# EAGLE design mini system (EAGLE 9.2.2)
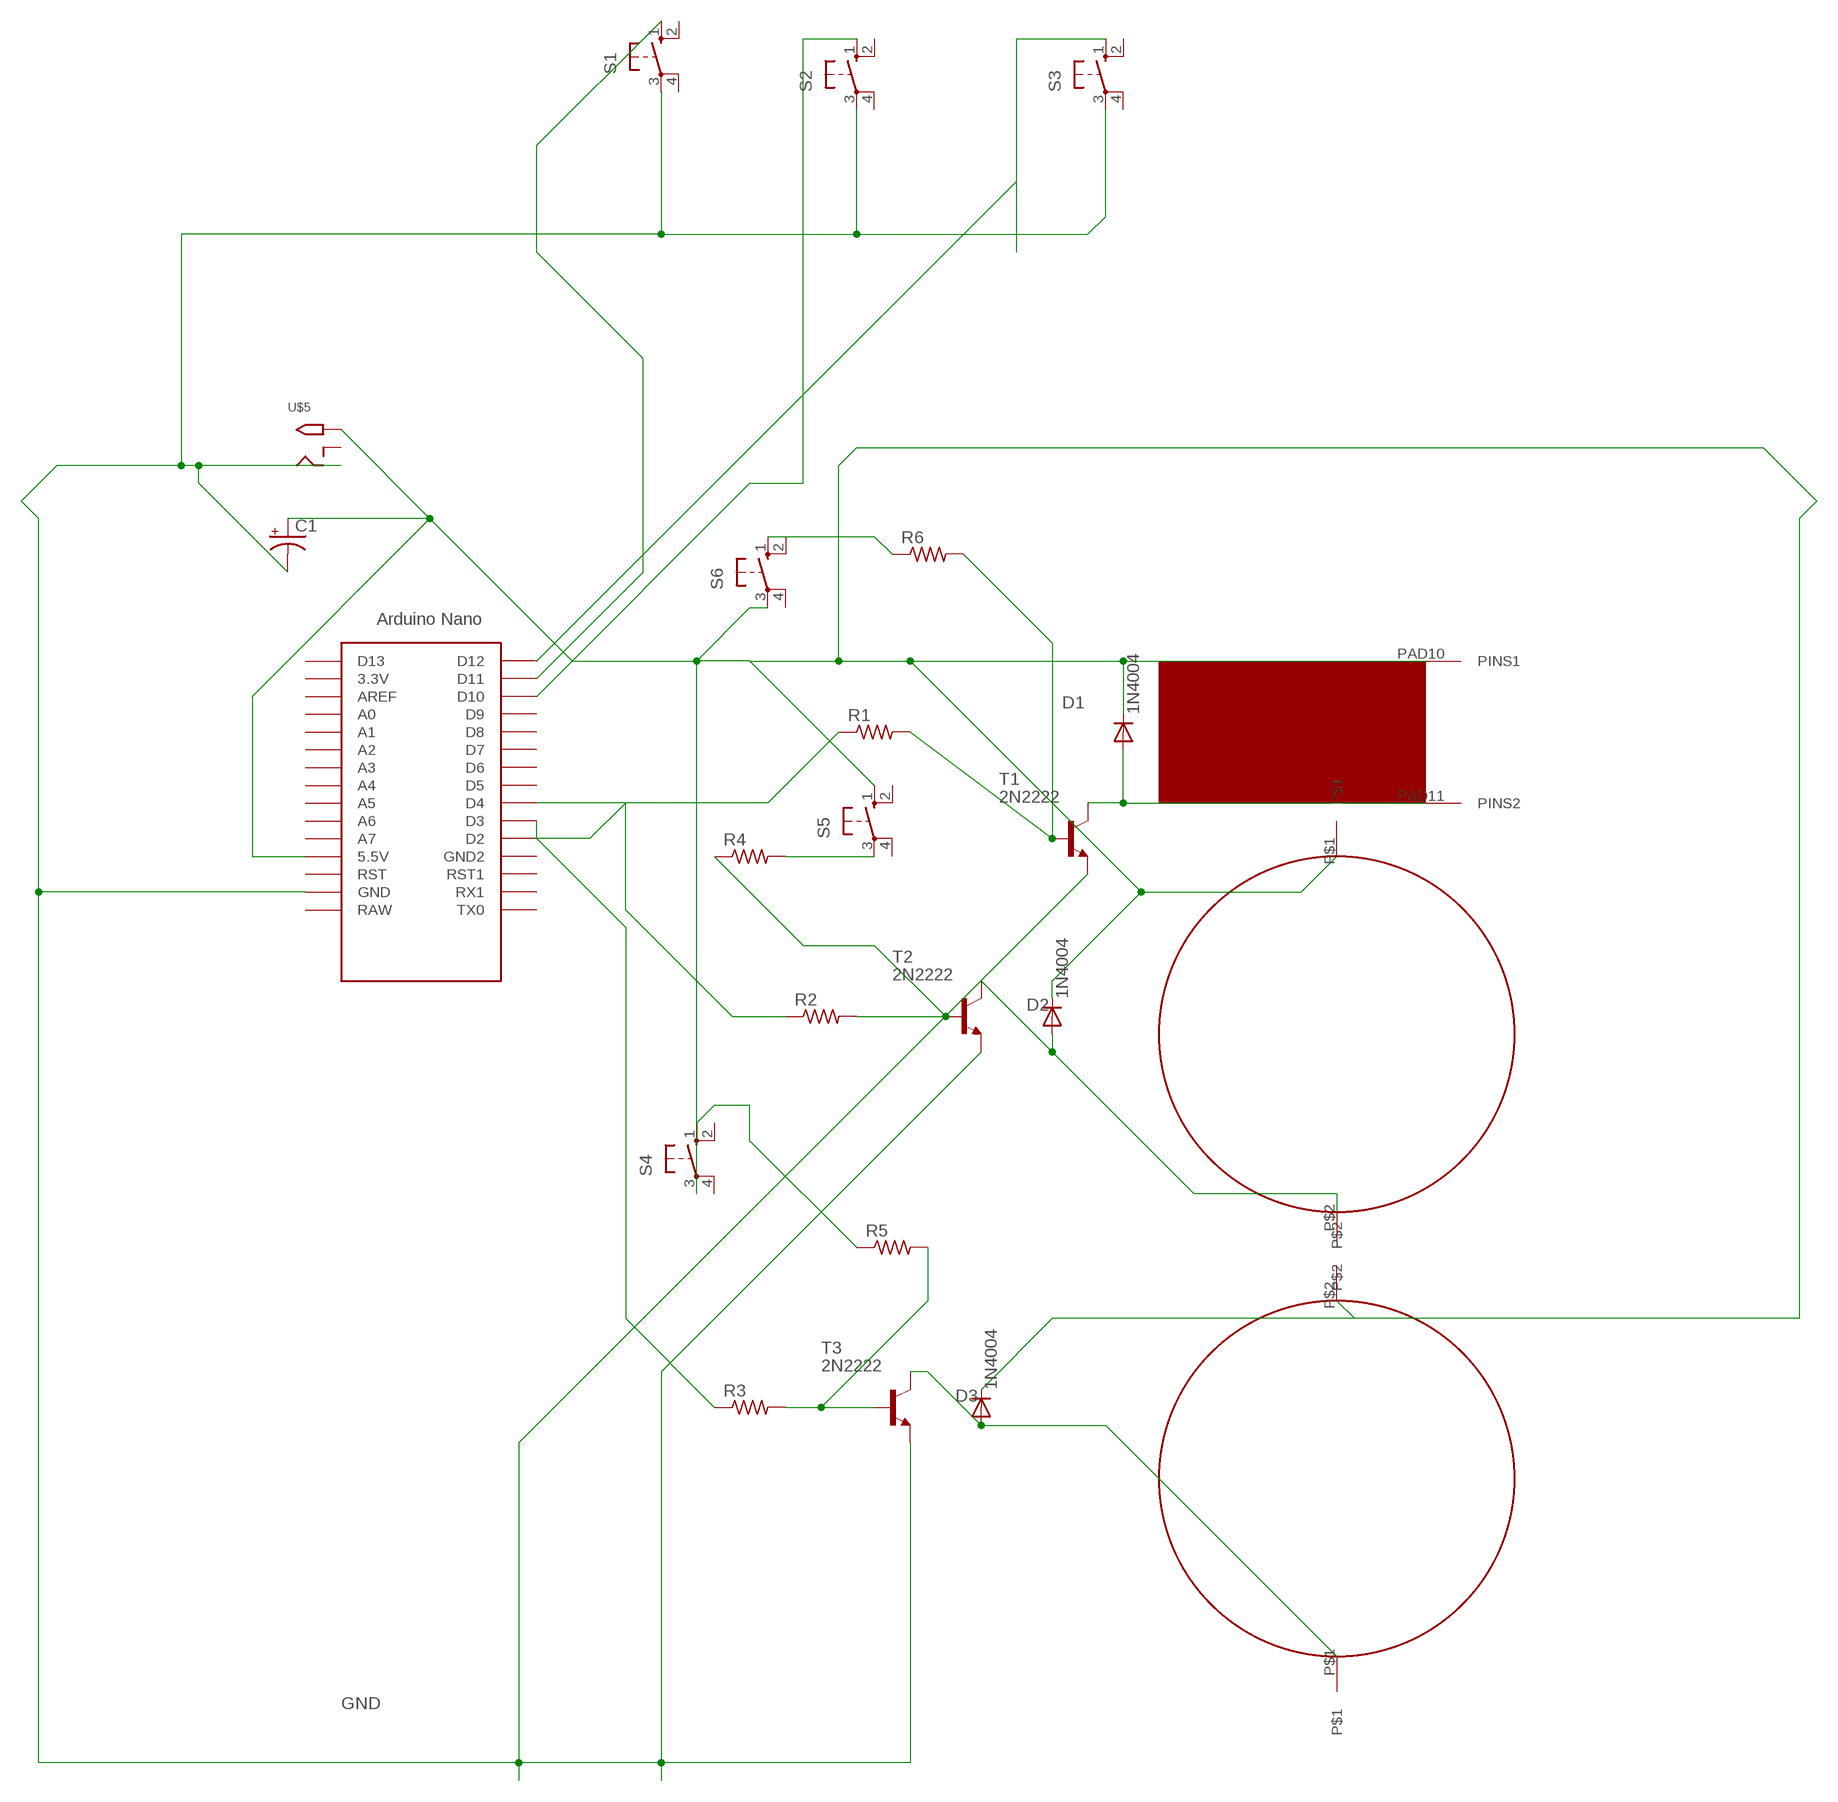
[diagram p0: schematic, sheet 1]

## Parts
C1  CPOL-USE2.5-5  [E2,5-5]
D1  1N4004  [DO41-10]
D2  1N4004  [DO41-10]
D3  1N4004  [DO41-10]
PUMP1  DCPUMP  [PUMP]
R1  R-US_0207/10  [0207/10]
R2  R-US_0207/10  [0207/10]
R3  R-US_0207/10  [0207/10]
R4  R-US_0207/10  [0207/10]
R5  R-US_0207/10  [0207/10]
R6  R-US_0207/10  [0207/10]
S1  10-XX  [B3F-10XX]
S2  10-XX  [B3F-10XX]
S3  10-XX  [B3F-10XX]
S4  10-XX  [B3F-10XX]
S5  10-XX  [B3F-10XX]
S6  10-XX  [B3F-10XX]
T1  2N2222  [TO92-EBC-OVAL]
T2  2N2222  [TO92-EBC-OVAL]
T3  2N2222  [TO92-EBC-OVAL]
U$1  NANO  [NANO]
U$2  VALVE  [VALVTEST2]
U$4  DCPUMP  [PUMP]
U$5  2.1MMJACKTHM  [PJ-102A]

## Nets
5V: C1.+ D1.C D2.C D3.C PUMP1.P$1 S4.3(P) S5.1(S) S6.3(P) U$1.5V(5.5V) U$2.PAD10(PINS1) U$4.P$2 U$5.TIP
GND: C1.- S1.3(P) S2.3(P) S3.3(P) T1.E T2.E T3.E U$1.GND U$5.RING
N$1: R1.2 R6.2 T1.B
N$2: R2.2 R4.1 T2.B
N$3: R3.2 R5.2 T3.B
N$4: R1.1 U$1.D4
N$5: D2.A PUMP1.P$2 T2.C
N$6: R3.1 U$1.D3
N$7: R2.1 U$1.D2
N$8: D1.A T1.C U$2.PAD11(PINS2)
N$9: D3.A T3.C U$4.P$1
N$10: R4.2 S5.3(P)
N$11: S1.1(S) U$1.D11
N$12: S2.1(S) U$1.D10
N$13: S3.1(S) U$1.D12
N$14: R6.1 S6.1(S)
N$15: R5.1 S4.1(S)
Unconnected: S1.2(S1) S1.4(P1) S2.2(S1) S2.4(P1) S3.2(S1) S3.4(P1) S4.2(S1) S4.4(P1) S5.2(S1) S5.4(P1) S6.2(S1) S6.4(P1) U$1.3.3V U$1.A0 U$1.A1 U$1.A2 U$1.A3 U$1.A4 U$1.A5 U$1.A6 U$1.A7 U$1.AREF U$1.D5 U$1.D6 U$1.D7 U$1.D8 U$1.D9 U$1.D13 U$1.GND1(GND2) U$1.RAW U$1.RST U$1.RST1 U$1.RX1 U$1.TX0 U$5.RING_SW

## Library data of the parts
C1 = adafruit:CPOL-US: POLARIZED CAPACITOR, American symbol
D1-D3 = adafruit:1N4004: DIODE General purpose 1N400x type rectifier (With bigger pads) http://www.ladyada.net/library/pcb/eaglelibrary.html
PUMP1 U$4 = local eagle library:DCPUMP
R1-R6 = adafruit:R-US_: RESISTOR, American symbol
S1-S6 = switch-omron:10-XX: OMRON SWITCH; MPN: B3F-1000; OC_FARNELL: 176432; OC_NEWARK: 36M3542
T1-T3 = adafruit:2N2222: NPN TRANSISTOR Big oval pads
U$1 = Arduino-clone:NANO: Arduino Nano
U$2 = local eagle library:VALVE: pn eumatic valve
U$5 = adafruit:2.1MMJACK: 2.1mm x 5.5mm THM DC jack with internal switch. Digikey part #PJ-102A, 4UCON part #05537 2.1mm x 5.5mm SMT DC jack with internal switch. Digikey part #PJ-002A-SMT, 4UCON part #03267 By microbuilder.eu & adafruit.com

## Board
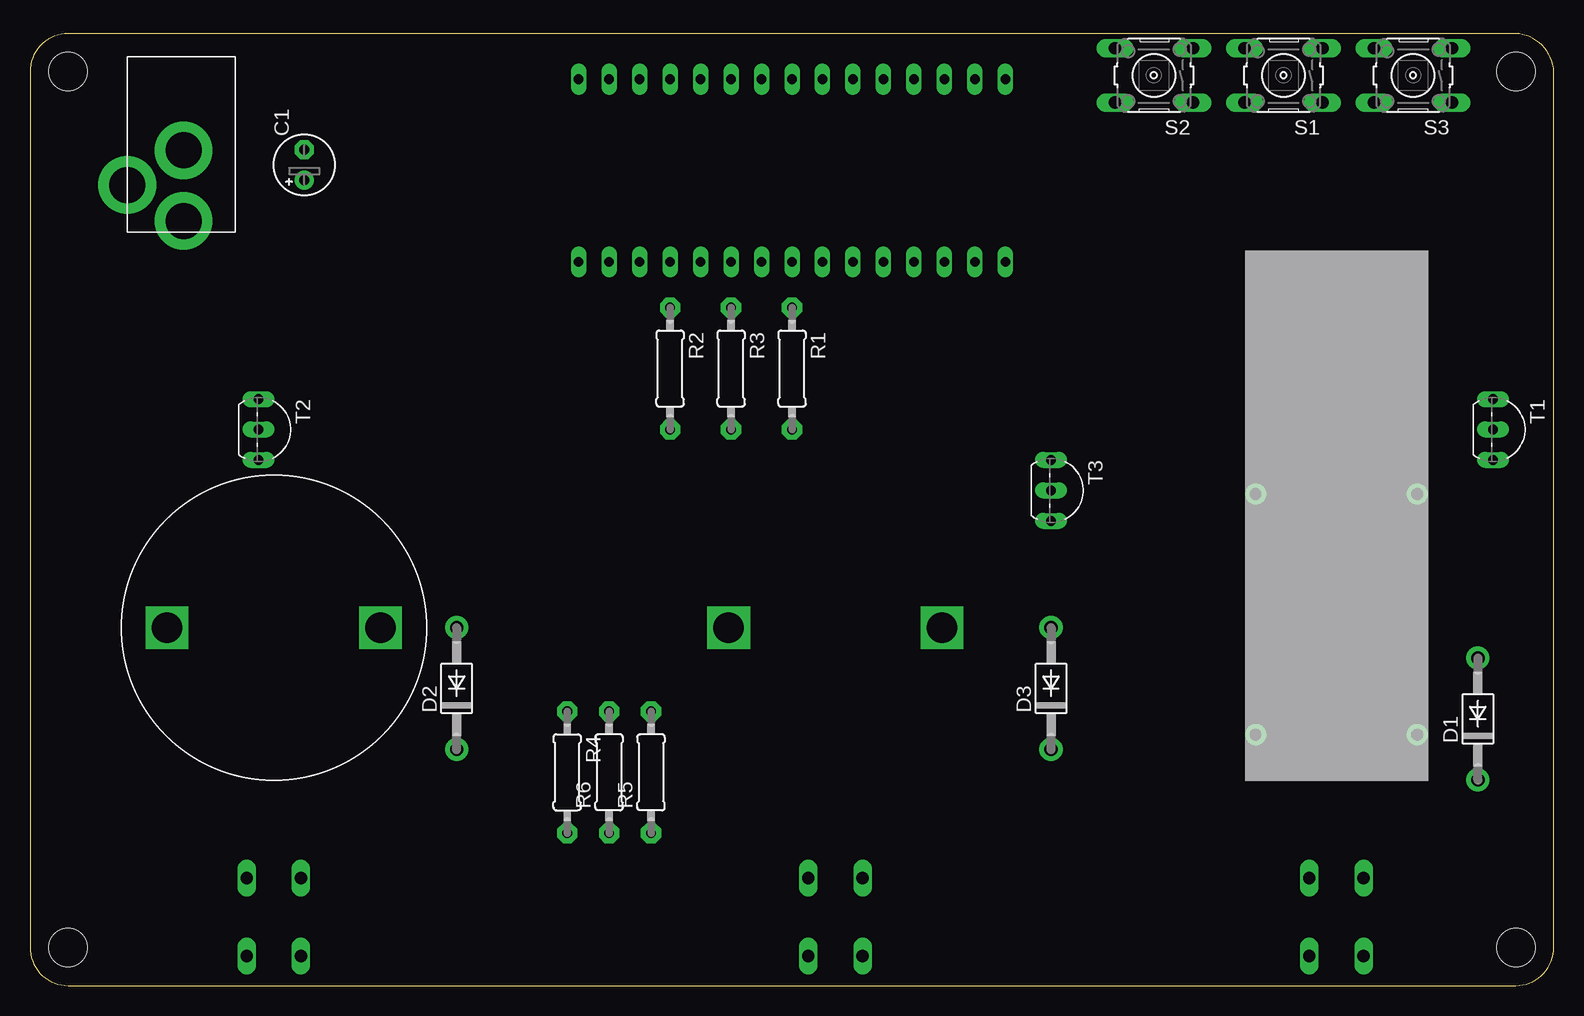
[diagram p1: board, top side]
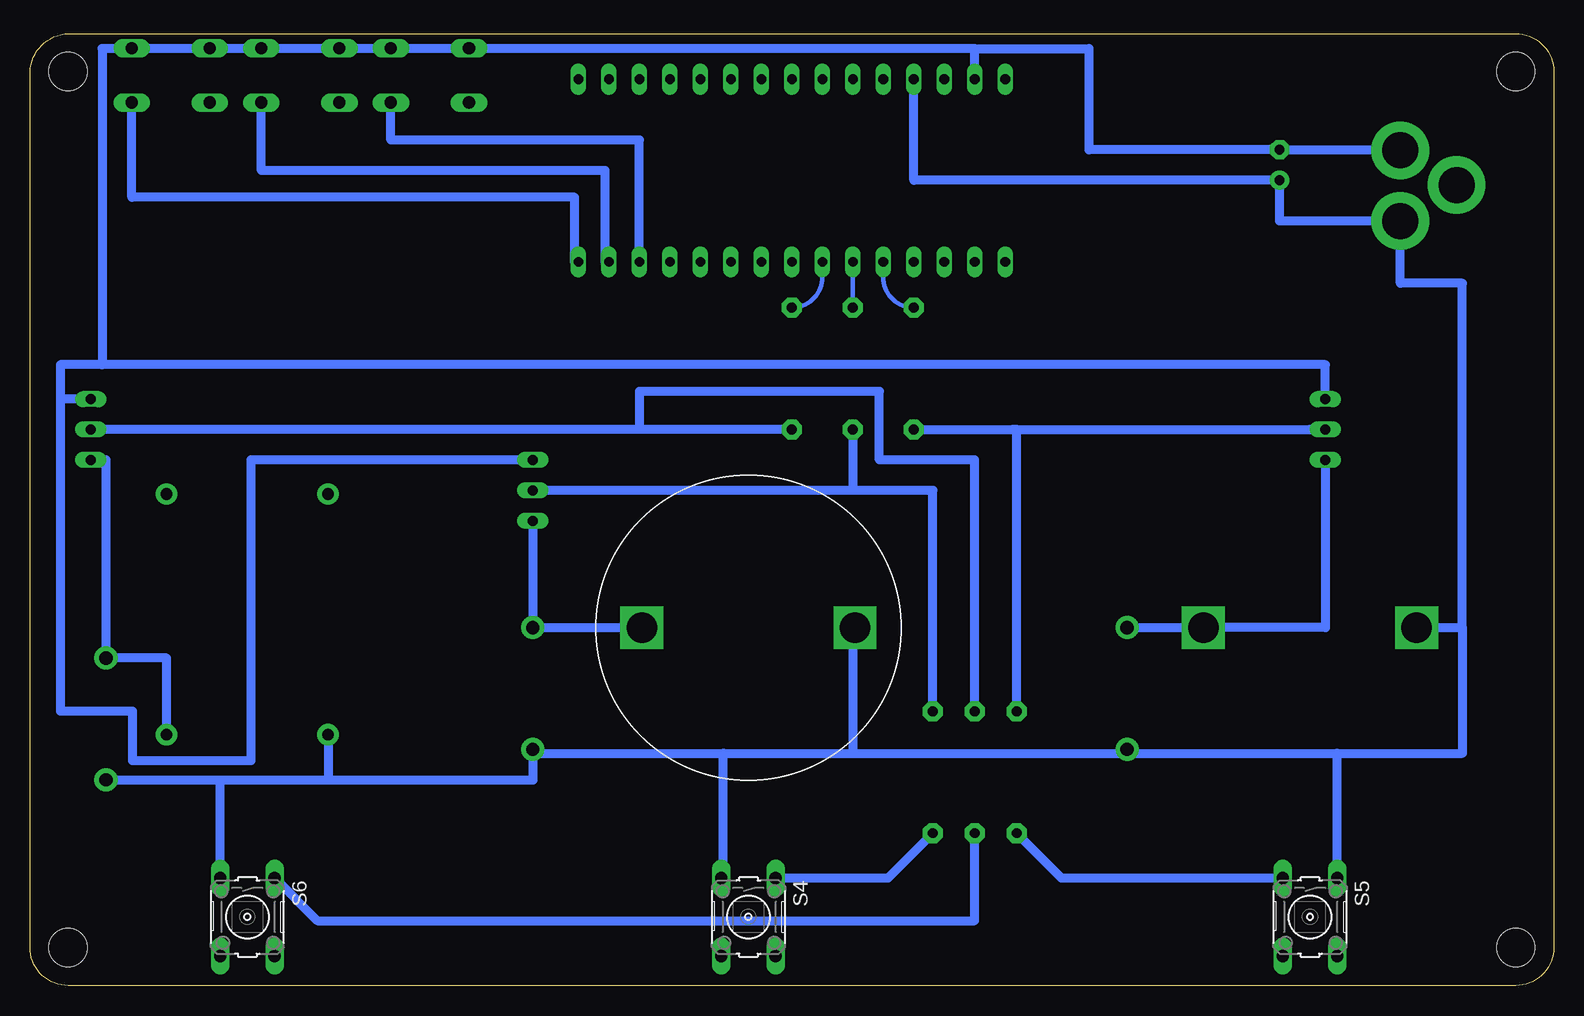
[diagram p2: board, bottom side, seen from below]

Size 126.99 x 79.37 mm. Coordinates in mm from the lower left corner, seen from the top.
Outline: 0,76.19 0,3.17 arc90 3.17,0 123.81,0 arc90 126.99,3.17 126.99,76.19 arc90 123.5,79.36 3.17,79.36 arc90 0,76.19
Copper layers (1*16): Top 0.035mm / dielectric 1.5mm / Bottom 0.035mm
Design rules "default": minimum track width 6mil, minimum drill 0.35mm, track to track 6mil, track to pad 6mil, pad to pad 6mil, via to via 6mil, smd to smd 6mil, copper to edge 40mil, drill to drill 6mil, minimum pad ring 10mil, minimum via ring 8mil, stop-mask expansion 4mil, vias tented up to drill 0mil, thermal gap 10mil
Holes 3.17 mm at 3.17,76.2 3.17,3.17 123.83,3.17 123.83,76.2

### Footprints (pad centres in the part's own frame; a part is rotated, then mirrored left to right if it is on the bottom)
E2,5-5 = drill 0.813 pad 1.6: + -1.27,0 | drill 0.813 pad 1.6 octagon: - 1.27,0
DO41-10 = drill 1.118 pad 1.93: A 5.08,0; C -5.08,0
PUMP = drill 2.54 square: P$1 -8.89,0; P$2 8.89,0
0207/10 = drill 0.813 pad 1.676 octagon: 1 -5.08,0; 2 5.08,0
B3F-10XX = drill 1.016 long: 1 -3.251,2.261; 2 3.251,2.261; 3 -3.251,-2.261; 4 3.251,-2.261
TO92-EBC-OVAL = drill 0.813 long: B 0,-1.27; C 2.54,-1.27; E -2.54,-1.27
NANO = drill 0.8 long: 3.3V -10.16,24.13; 5V -10.16,-1.27; A0 -10.16,19.05; A1 -10.16,16.51; A2 -10.16,13.97; A3 -10.16,11.43; A4 -10.16,8.89; A5 -10.16,6.35; A6 -10.16,3.81; A7 -10.16,1.27; AREF -10.16,21.59; D2 5.08,1.27; D3 5.08,3.81; D4 5.08,6.35; D5 5.08,8.89; D6 5.08,11.43; D7 5.08,13.97; D8 5.08,16.51; D9 5.08,19.05; D10 5.08,21.59; D11 5.08,24.13; D12 5.08,26.67; D13 -10.16,26.67; GND -10.16,-6.35; GND1 5.08,-1.27; RAW -10.16,-8.89; RST -10.16,-3.81; RST1 5.08,-3.81; RX1 5.08,-6.35; TX0 5.08,-8.89
VALVTEST2 = drill 0.965 pad 1.778: PAD10 3.835,-0.864; PAD11 3.835,-14.326; PAD12 23.901,-14.326; PAD13 23.901,-0.864
PJ-102A = drill 3 pad 4.8: RING 0.1,-3.39; RING_SW -4.6,-6.29; TIP 0.1,-9.29

### Placement (x,y rotation side)
C1  22.86,68.41 90 top
D1  120.65,22.23 90 top
D2  35.56,24.77 90 top
D3  85.09,24.77 90 top
PUMP1  20.32,29.84 0 top
R1  63.5,51.44 270 top
R2  53.34,51.44 270 top
R3  58.42,51.44 270 top
R4  44.77,17.78 270 top
R5  51.75,17.78 90 top
R6  48.26,17.78 90 top
S1  104.46,75.88 180 top
S2  93.66,75.88 180 top
S3  115.25,75.88 180 top
S4  67.12,5.71 270 bottom
S5  20.32,5.71 270 bottom
S6  108.87,5.71 270 bottom
T1  123.19,46.36 270 top
T2  20.32,46.36 270 top
T3  86.36,41.27 270 top
U$1  54.61,65.41 270 top
U$2  101.28,17.08 90 top
U$4  67.12,29.84 0 bottom
U$5  12.7,73.02 0 top

### Tracks (layer width: path | path; a pad name or v marks a point on that pad's centre or on a via)
5V
  Bottom 0.762: 7.62,29.84 7.62,58.55 12.8,58.55 U$5.TIP 22.86,63.74 C1.+ 53.34,67.14 U$1.5V | 7.62,29.84 7.62,19.37 18.06,19.37 | U$2.PAD10 102.14,17.15 | 102.14,17.15 85.09,17.15 85.09,19.37 | 85.09,19.37 69.22,19.37 | 69.22,19.37 58.42,19.37 | 58.42,19.37 35.56,19.37 | 35.56,19.37 18.06,19.37 | PUMP1.P$1 7.62,29.84 | U$4.P$2 arc-90 58.42,29.65 58.42,19.37 | D1.C 111.13,17.15 | 111.13,17.15 102.14,17.15 | D2.C 35.56,19.37 | D3.C 85.09,19.37 | S5.1 18.06,19.37 | S4.3 69.22,8.97 69.22,19.37 | S6.3 111.13,17.15
GND
  Bottom 0.762: 124.46,48.9 124.46,51.75 120.97,51.75 | 124.46,48.9 124.46,22.86 118.43,22.86 118.43,18.73 108.58,18.73 108.58,43.82 T3.E | U$1.GND 48.26,78.1 | 48.26,78.1 96.84,78.1 | 96.84,78.1 107.63,78.1 | 107.63,78.1 118.5,78.1 | 118.5,78.1 120.97,78.1 120.97,51.75 | 48.26,78.1 38.73,78.1 38.73,69.68 C1.- 12.8,69.68 U$5.RING | T2.E 19.05,51.75 120.97,51.75 | S2.3 96.84,78.14 96.84,78.1 | S1.3 107.63,78.14 107.63,78.1 | S3.3 118.5,78.1 | T1.E 124.46,48.9
N$1
  Bottom 0.762: R1.2 76.2,46.36 | 76.2,46.36 T1.B | R6.2 48.26,43.82 56.2,43.82 56.2,49.53 76.2,49.53 76.2,46.36
N$2
  Bottom 0.762: 20.32,46.36 T2.B 44.77,46.36 | R2.2 45.09,46.36 44.77,46.36 | R4.1 44.77,46.36
N$3
  Bottom 0.762: R3.2 58.42,41.27 | 58.42,41.27 59.37,41.27 T3.B | R5.2 51.75,41.27 58.42,41.27
N$4
  Bottom 0.254: U$1.D4 60.96,59.05
  Bottom 0.381: 60.96,59.05 arc90 R1.1
N$5
  Bottom 0.762: D2.A PUMP1.P$2 19.05,29.84 T2.C
N$6
  Bottom 0.381: U$1.D3 R3.1
N$7
  Bottom 0.254: U$1.D2 55.88,59.05
  Bottom 0.381: 55.88,59.05 arc-90 R2.1
N$8
  Bottom 0.762: T1.C arc-90 120.65,43.82 D1.A 115.6,27.3 U$2.PAD11
N$9
  Bottom 0.762: U$4.P$1 D3.A T3.C
N$10
  Bottom 0.762: R4.2 41.03,8.97 S5.3
N$11
  Bottom 0.762: U$1.D11 79.06,60.32 79.06,67.94 107.71,67.94 S1.1
N$12
  Bottom 0.762: U$1.D10 76.2,70.48 96.91,70.48 S2.1
N$13
  Bottom 0.762: U$1.D12 81.6,60.32 81.6,65.72 118.5,65.72 S3.1
N$14
  Bottom 0.762: S6.1 103.04,5.4 48.26,5.4 R6.1
N$15
  Bottom 0.762: S4.1 55.49,8.97 R5.1